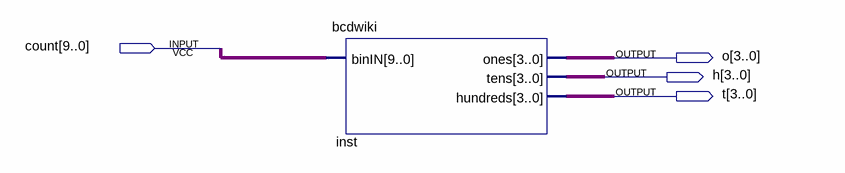
[diagram p0: schematic sheet]
// Quartus schematic test.bdf as structural Verilog: 1 symbols, 4 pins
module test (
  input  [9:0] count,
  output [3:0] o,
  output [3:0] h,
  output [3:0] t
);

  bcdwiki inst (.binIN(count), .ones(o), .tens(h), .hundreds(t));
endmodule
